# EAGLE design 74HC595 Shift Reg Breakout-v11 (EAGLE 5.06)
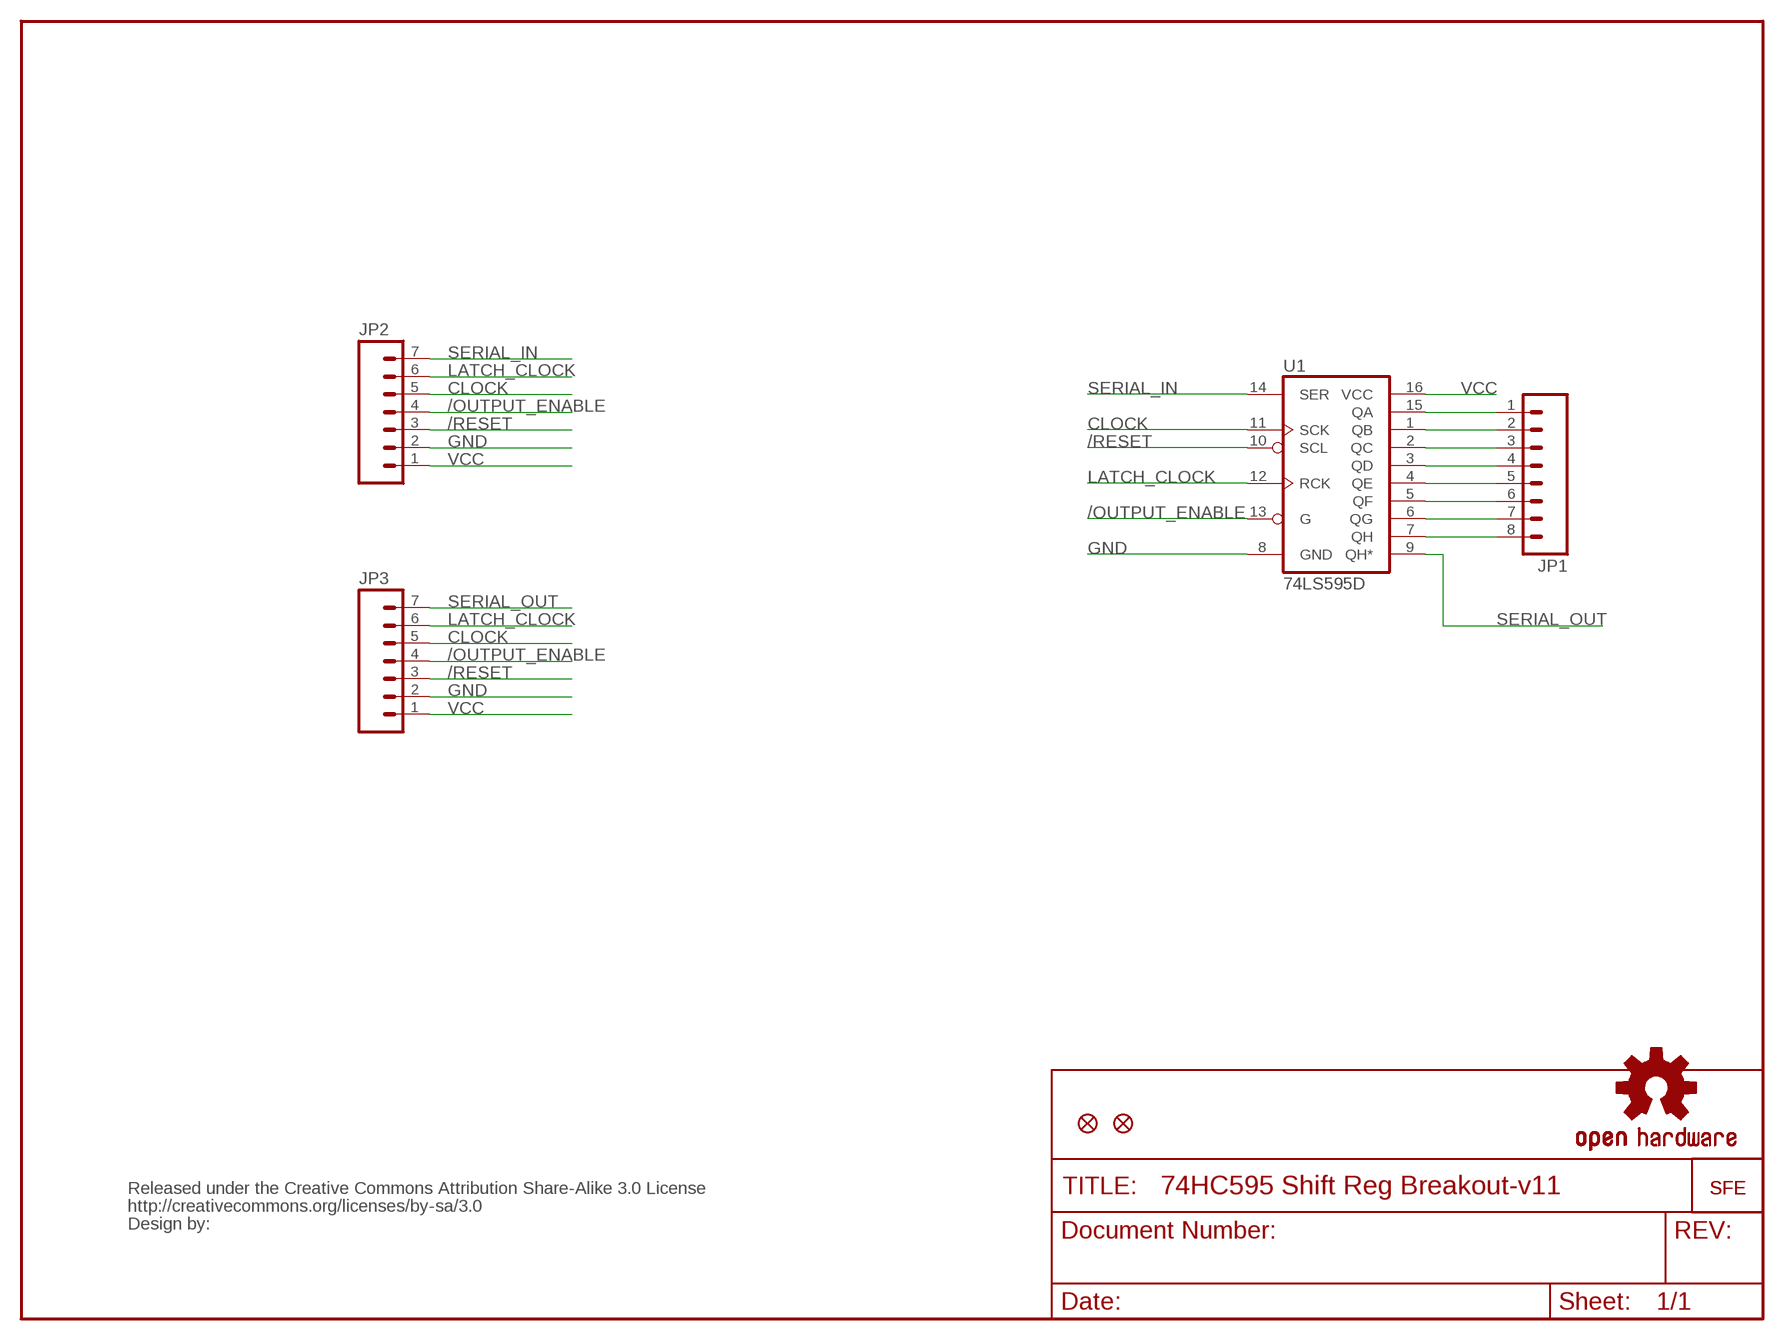
[diagram p0: schematic, sheet 1]

## Parts
JP1  M08  [1X08]
JP2  M07  [1X07]
JP3  M07  [1X07]
JP4  LOGO-SFENEW  [SFE-NEW-WEBLOGO]
JP5  LOGO-SFESK  [SFE-LOGO-FLAME]
JP6  FIDUCIAL1X2.5  [FIDUCIAL-1X2.5]
JP7  FIDUCIAL1X2.5  [FIDUCIAL-1X2.5]
U1  74LS595D  [SO16]
U$1  OSHW-LOGOM  [OSHW-LOGO-M]
U$2  CREATIVE_COMMONS  [CREATIVE_COMMONS]

## Nets
/OUTPUT_ENABLE: JP2.4 JP3.4 U1.13(G)
/RESET: JP2.3 JP3.3 U1.10(SCL)
CLOCK: JP2.5 JP3.5 U1.11(SCK)
GND: JP2.2 JP3.2 U1.8(GND)
LATCH_CLOCK: JP2.6 JP3.6 U1.12(RCK)
N$3: JP1.1 U1.15(QA)
N$4: JP1.2 U1.1(QB)
N$5: JP1.3 U1.2(QC)
N$6: JP1.4 U1.3(QD)
N$7: JP1.5 U1.4(QE)
N$8: JP1.6 U1.5(QF)
N$9: JP1.7 U1.6(QG)
N$10: JP1.8 U1.7(QH)
SERIAL_IN: JP2.7 U1.14(SER)
SERIAL_OUT: JP3.7 U1.9(QH*)
VCC: JP2.1 JP3.1 U1.16(VCC)

## Library data of the parts
JP1 = SparkFun:M08: Header 8 Standard 8-pin 0.1" header. Use with straight break away headers (SKU : PRT-00116), right angle break away headers (PRT-00553), swiss pins (PRT-00743), machine pins (PRT-00117), and female headers (PRT-00115).
JP2 JP3 = SparkFun:M07: Header 7 Standard 7-pin 0.1" header. Use with straight break away headers (SKU : PRT-00116), right angle break away headers (PRT-00553), swiss pins (PRT-00743), machine pins (PRT-00117), and female headers (PRT-00115). NOTES ON THE VARIANTS LOCK and LOCK_LONGPADS... This footprint was designed to help hold the alignment of a through-hole component (i.e. 7-pin header) while soldering it into place. You may notice that each hole has been shifted either up or down by 0.005 of an inch from it's more standard position (which is usually a perfectly straight line). This slight alteration caused the pins (the squares in the middle) to touch the edges of the holes. Because they are alternating, it causes a "brace" to hold the header in place. 0.005 has proven to be the perfect amount of "off-center" position when using our standard breakaway headers. Although looks a little odd when you look at the bare footprint, once you have a header in there, the alteration is very hard to notice. Also, if you push a header all the way into place, it is covered up entirely on the bottom side. This idea of altering the position of holes to aid alignment will be further integrated into the Sparkfun Library for other footprints. It can help hold any component with 3 or more connection pins.
JP4 JP5 = SparkFun:LOGO-SFE: Spark Fun Electronics PCB Logo This is the standard Spark Fun Electronics PCB logo.
JP6 JP7 = abes:FIDUCIAL: Fiducial Alignment Points Various fiducial points for machine vision alignment.
U1 = SparkFun:74*595: 8-bit SHIFT REGISTER, output latch
U$1 = SparkFun:OSHW-LOGO: Open Source Hardware Logo This logo indicates the piece of hardware it is found on incorporates a OSHW license and/or adheres to the definition of open source hardware found here: http://freedomdefined.org/OSHW
U$2 = SparkFun:CREATIVE_COMMONS

## Board
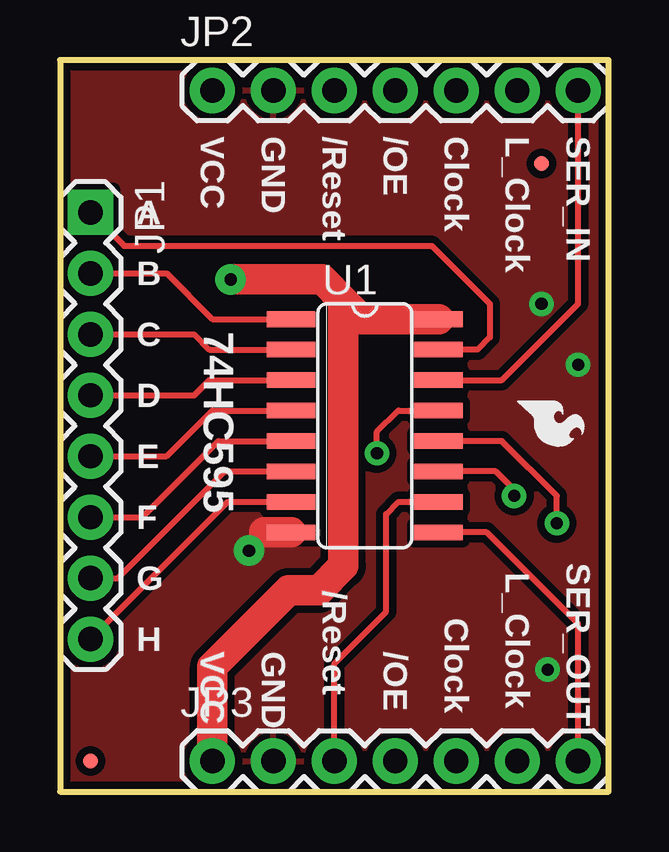
[diagram p1: board, top side]
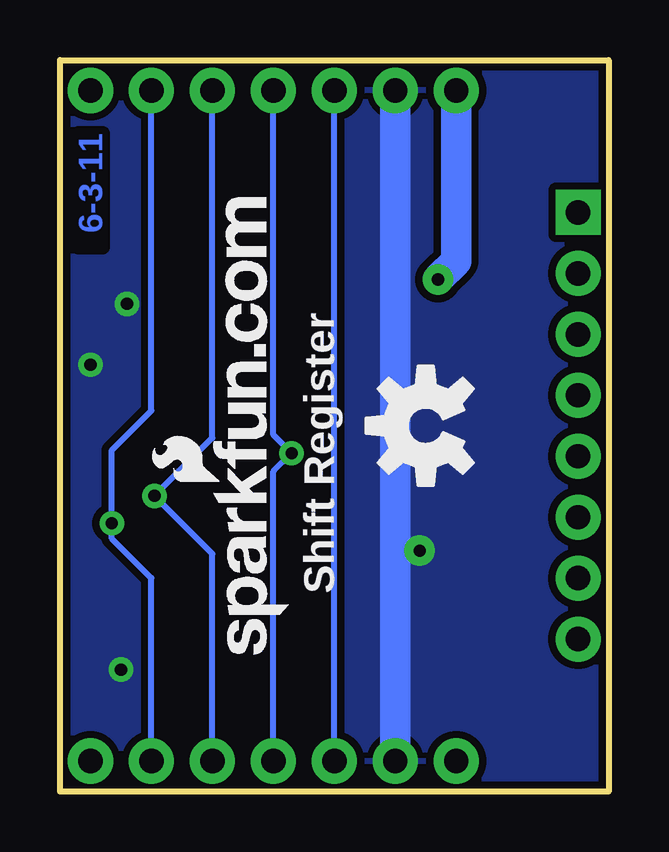
[diagram p2: board, bottom side, seen from below]

Size 22.86 x 30.48 mm. Coordinates in mm from the lower left corner, seen from the top.
Outline: 0,0 22.86,0 22.86,30.48 0,30.48 0,0
Copper layers (1*16): Top 0.035mm / dielectric 1.5mm / Bottom 0.035mm
Design rules "SparkFun": minimum track width 8mil, minimum drill 20mil, track to track 8mil, track to pad 8mil, pad to pad 8mil, via to via 8mil, smd to smd 8mil, copper to edge 8mil, drill to drill 8mil, minimum pad ring 12mil, minimum via ring 10mil, stop-mask expansion 4mil, vias tented up to drill 20mil, thermal gap 10mil

### Footprints (pad centres in the part's own frame; a part is rotated, then mirrored left to right if it is on the bottom)
1X08 = drill 1.016 pad 1.88 square: 1 0,0 | drill 1.016 pad 1.88 round: 2 2.54,0; 3 5.08,0; 4 7.62,0; 5 10.16,0; 6 12.7,0; 7 15.24,0; 8 17.78,0
1X07 = drill 1.016 pad 1.88 round: 1 0,0; 2 2.54,0; 3 5.08,0; 4 7.62,0; 5 10.16,0; 6 12.7,0; 7 15.24,0
FIDUCIAL-1X2.5 = smd 0.635 x 0.635: 1 0,0
SO16 = smd 0.66 x 2.032: 1 -4.445,-3.073; 2 -3.175,-3.073; 3 -1.905,-3.073; 4 -0.635,-3.073; 5 0.635,-3.073; 6 1.905,-3.073; 7 3.175,-3.073; 8 4.445,-3.073; 9 4.445,3.073; 10 3.175,3.073; 11 1.905,3.073; 12 0.635,3.073; 13 -0.635,3.073; 14 -1.905,3.073; 15 -3.175,3.073; 16 -4.445,3.073

### Placement (x,y rotation side)
JP1  1.27,24.13 270 top
JP2  6.35,29.21 0 top
JP3  6.35,1.27 0 top
JP4  13.34,5.71 90 bottom
JP5  19.05,16.26 270 top
JP6  1.27,1.27 0 top
JP7  20.07,26.16 0 top
U1  12.7,15.24 270 top
U$1  7.62,15.24 90 bottom
U$2  21.59,-12.7 0 top  (outside the outline)

### Tracks (layer width: path | path; a pad name or v marks a point on that pad's centre or on a via)
/OUTPUT_ENABLE  (via drill 0.51)
  Top 0.254: v13.21,14.1 13.21,14.99 14.1,15.88 U1.13
  Bottom 0.254: JP3.4 13.97,13.34 v13.21,14.1 13.97,14.86 JP2.4
/RESET
  Top 0.254: U1.10 14.1,12.06 13.59,11.56 13.59,7.49 11.43,5.33 JP3.3
  Bottom 0.254: JP3.3 JP2.3
CLOCK  (via drill 0.51)
  Top 0.254: v18.92,12.32 18.92,12.57 18.16,13.34 U1.11
  Bottom 0.254: JP3.5 16.51,9.91 v18.92,12.32 16.51,14.73 JP2.5
GND  (via drill 0.51, 0.51 pad 1.27)
  Top 0.254: 8.51,10.79 8.26,10.79
  Top 1.27: U1.8 8.51,10.79
  Bottom 1.27: JP3.2 JP2.2
  other vias: 7.87,10.03 20.07,20.32 20.32,5.08 21.59,17.78
  pour Top (isolate 0.305): 22.86,30.48 22.86,0 0,0 0,30.48
  pour Bottom (isolate 0.305): 22.86,30.48 0,30.48 0,0 22.86,0
LATCH_CLOCK  (via drill 0.51)
  Top 0.254: U1.12 18.41,14.61 20.7,12.32 v20.7,11.18
  Bottom 0.254: JP2.6 19.05,15.88 20.7,14.22 v20.7,11.18 20.7,10.54 19.05,8.89 JP3.6
N$3
  Top 0.254: U1.15 17.4,18.41 17.91,18.92 17.91,20.32 15.49,22.73 2.67,22.73 JP1.1
N$4
  Top 0.254: JP1.2 4.45,21.59 6.35,19.68 U1.1
N$5
  Top 0.254: JP1.3 5.59,19.05 6.22,18.41 U1.2
N$6
  Top 0.254: JP1.4 5.59,16.51 6.22,17.14 U1.3
N$7
  Top 0.254: JP1.5 4.45,13.97 6.35,15.88 U1.4
N$8
  Top 0.254: JP1.6 3.43,11.43 6.6,14.61 U1.5
N$9
  Top 0.254: JP1.7 2.41,8.89 6.86,13.34 U1.6
N$10
  Top 0.254: U1.7 6.99,12.06 JP1.8
SERIAL_IN
  Top 0.254: JP2.7 21.59,20.32 18.41,17.14 U1.14
SERIAL_OUT
  Top 0.254: JP3.7 21.59,6.99 17.78,10.79 U1.9
VCC  (via drill 0.51 pad 1.27)
  Top 1.27: JP3.1 6.35,5.21 9.53,8.38 10.79,8.38 11.81,9.4 11.81,20.45 | U1.16 12.57,19.68 11.81,20.45 | v7.11,21.34 10.92,21.34 11.81,20.45
  Bottom 1.27: JP2.1 6.35,22.1 v7.11,21.34

### Text on the board
Bottom: 6-3-11
tPlace: VCC | GND | /Reset | /OE | Clock | L_Clock | SER_IN | A | B | C | 74HC595 | D | E | F | SER_OUT | L_Clock | G | /Reset | Clock | H | VCC | GND | /OE
bPlace: Shift Register